# Altium schematic sheet zdoks.SchDoc: ZDOK Interfaces
size A3; Date: DO NOT USE, RATHER USE PROJ OPTIONS; DrawnBy: DO NOT USE, RATHER USE PROJ OPTIONS; Engineer: DO NOT USE, RATHER USE PROJ OPTIONS; Organization: DO NOT USE, RATHER USE PROJ OPTIONS; DocumentNumber: DO NOT USE, RATHER USE PROJ OPTIONS; Revision: DO NOT USE, RATHER USE PROJ OPTIONS; SheetNumber: 22; SheetTotal: 27; SCH_Sheet_Filename: zdoks.SchDoc; CurrentTime: DO NOT USE, RATHER USE PROJ OPTIONS; Time: DO NOT USE, RATHER USE PROJ OPTIONS; DocumentFullPathAndName: DO NOT USE, RATHER USE PROJ OPTIONS; DocumentName: DO NOT USE, RATHER USE PROJ OPTIONS; ModifiedDate: DO NOT USE, RATHER USE PROJ OPTIONS; ImagePath: DO NOT USE, RATHER USE PROJ OPTIONS
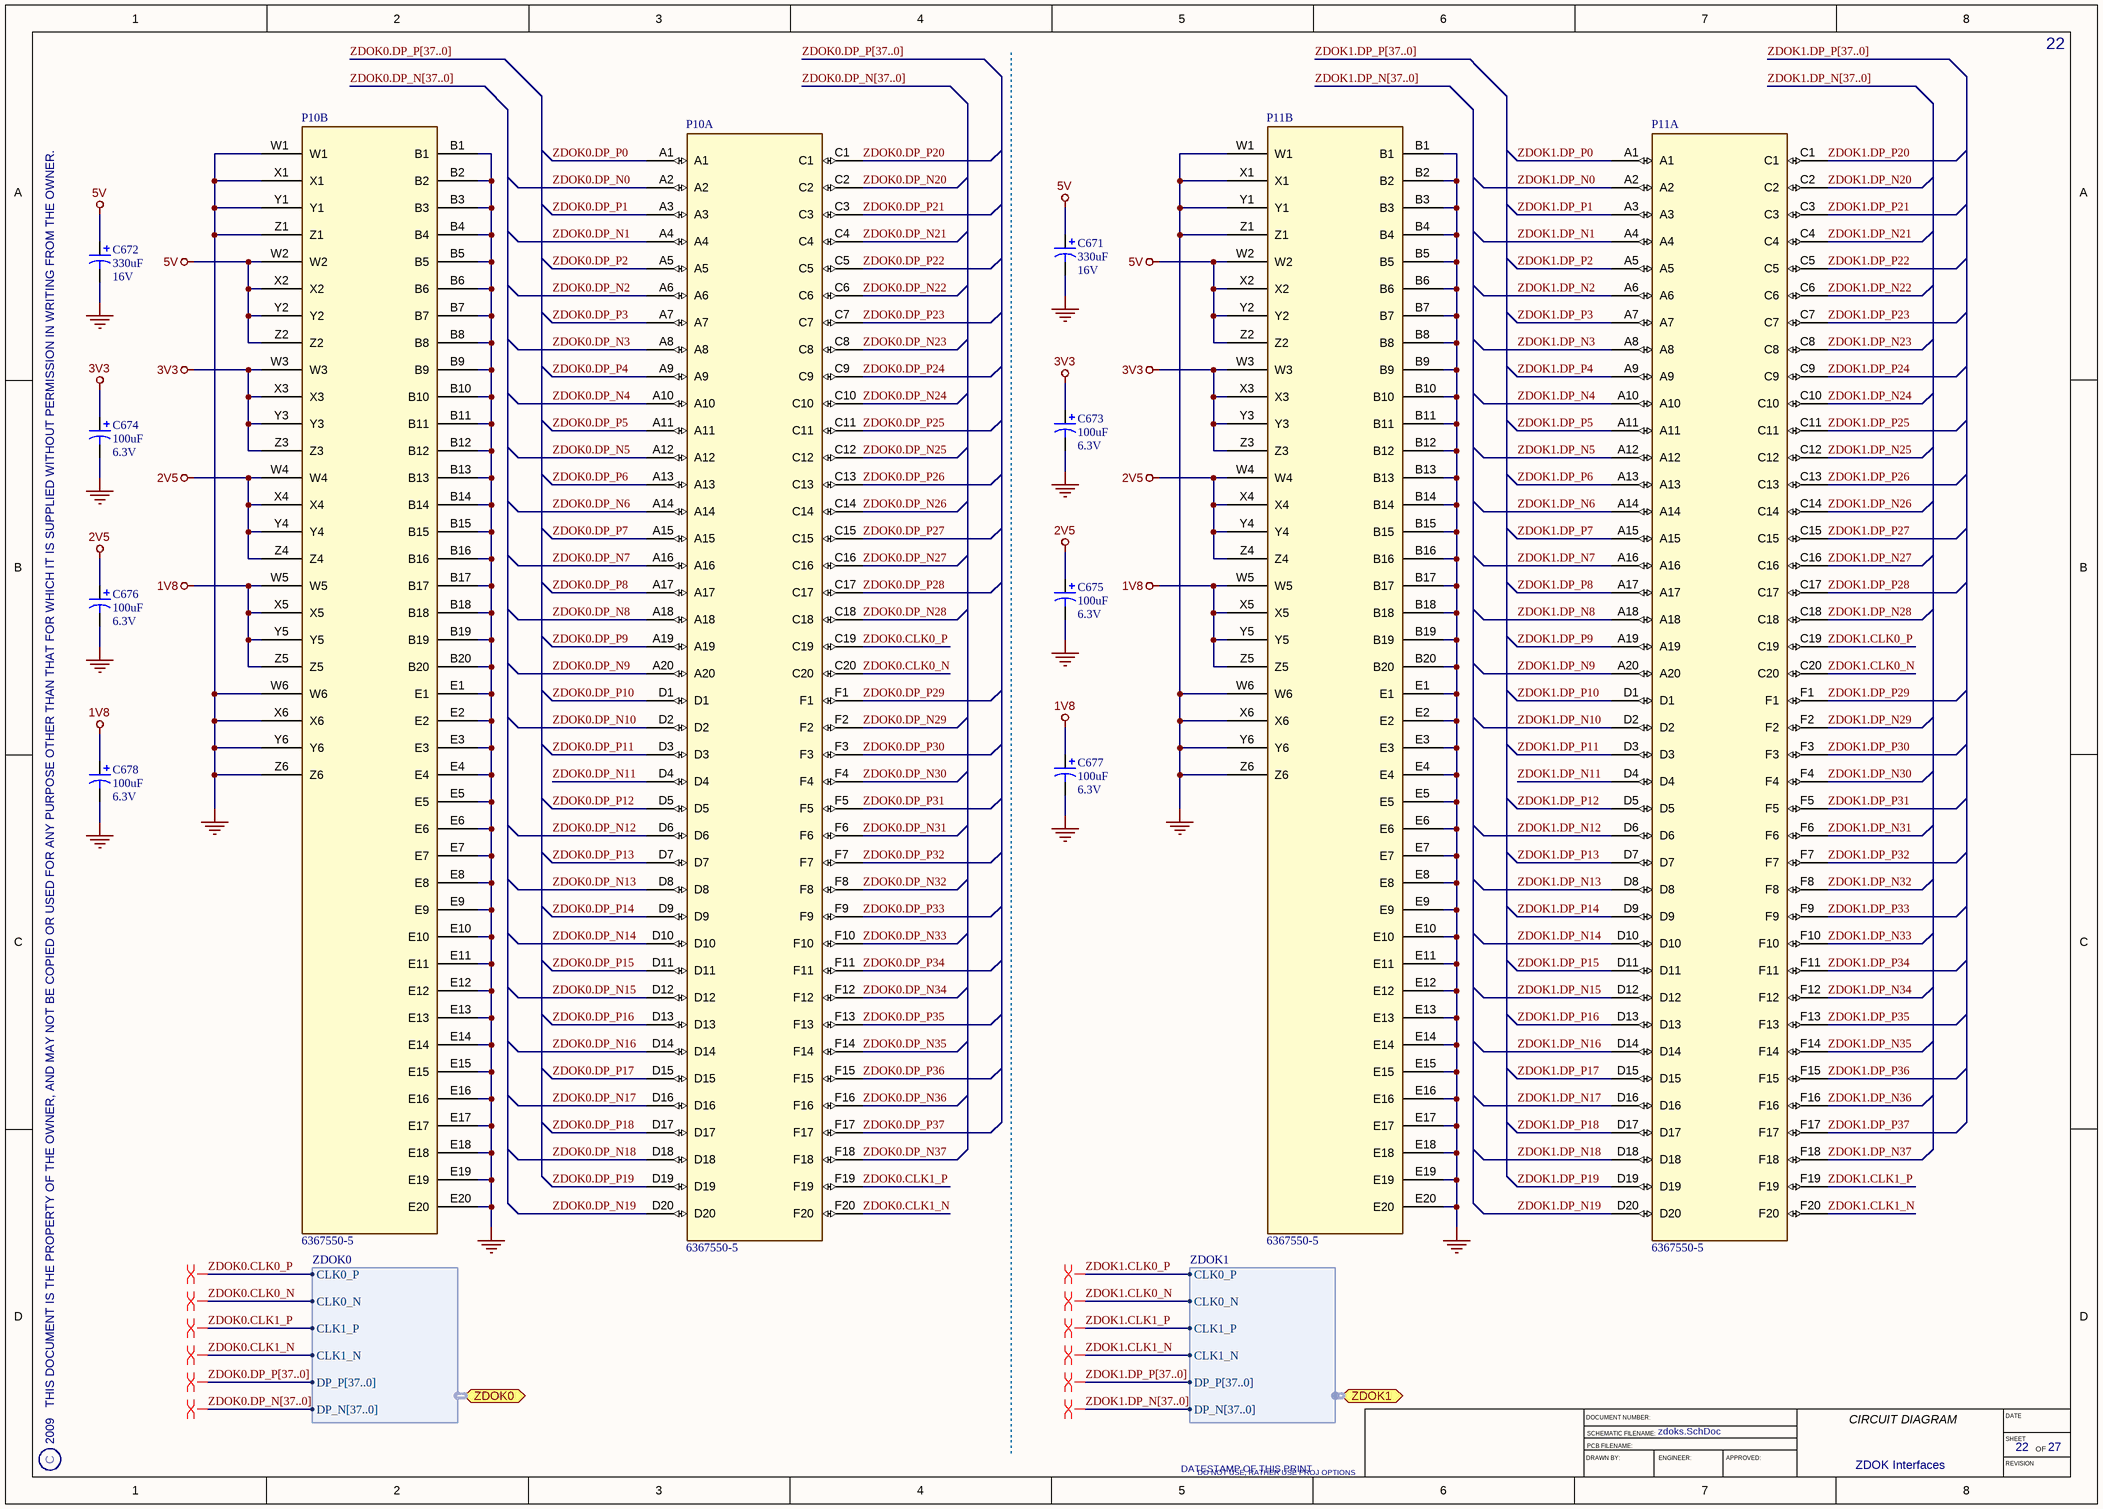
[diagram p0: zdoks.SchDoc]

## Parts
C671  Rating: 16V  [CAPMP7263X380L]  (hidden comment: 330uF)
C672  Rating: 16V  [CAPMP7263X380L]  (hidden comment: 330uF)
C673  Rating: 6.3V  [CAPMP3528X210L]  (hidden comment: 100uF)
C674  Rating: 6.3V  [CAPMP3528X210L]  (hidden comment: 100uF)
C675  Rating: 6.3V  [CAPMP3528X210L]  (hidden comment: 100uF)
C676  Rating: 6.3V  [CAPMP3528X210L]  (hidden comment: 100uF)
C677  Rating: 6.3V  [CAPMP3528X210L]  (hidden comment: 100uF)
C678  Rating: 6.3V  [CAPMP3528X210L]  (hidden comment: 100uF)
P10  6367550-5  [TYCO_6367550-5]  (parts A,B of 2)
P11  6367550-5  [TYCO_6367550-5]  (parts A,B of 2)

## Ports
ZDOK0 (harness ZDOK0), ZDOK1 (harness ZDOK1)

## Harnesses
ZDOK0: CLK0_P, CLK0_N, CLK1_P, CLK1_N, DP_P[37..0], DP_N[37..0]
ZDOK1: CLK0_P, CLK0_N, CLK1_P, CLK1_N, DP_P[37..0], DP_N[37..0]

## Nets
1V8: C677.1 C678.1 P10.W5 P10.X5 P10.Y5 P10.Z5 P11.W5 P11.X5 P11.Y5 P11.Z5
2V5: C675.1 C676.1 P10.W4 P10.X4 P10.Y4 P10.Z4 P11.W4 P11.X4 P11.Y4 P11.Z4
3V3: C673.1 C674.1 P10.W3 P10.X3 P10.Y3 P10.Z3 P11.W3 P11.X3 P11.Y3 P11.Z3
5V: C671.1 C672.1 P10.W2 P10.X2 P10.Y2 P10.Z2 P11.W2 P11.X2 P11.Y2 P11.Z2
GND: C671.2 C672.2 C673.2 C674.2 C675.2 C676.2 C677.2 C678.2 P10.B1 P10.B2 P10.B3 P10.B4 P10.B5 P10.B6 P10.B7 P10.B8 P10.B9 P10.B10 P10.B11 P10.B12 P10.B13 P10.B14 P10.B15 P10.B16 P10.B17 P10.B18 P10.B19 P10.B20 P10.E1 P10.E2 P10.E3 P10.E4 P10.E5 P10.E6 P10.E7 P10.E8 P10.E9 P10.E10 P10.E11 P10.E12 P10.E13 P10.E14 P10.E15 P10.E16 P10.E17 P10.E18 P10.E19 P10.E20 P10.W1 P10.W6 P10.X1 P10.X6 P10.Y1 P10.Y6 P10.Z1 P10.Z6 P11.B1 P11.B2 P11.B3 P11.B4 P11.B5 P11.B6 P11.B7 P11.B8 P11.B9 P11.B10 P11.B11 P11.B12 P11.B13 P11.B14 P11.B15 P11.B16 P11.B17 P11.B18 P11.B19 P11.B20 P11.E1 P11.E2 P11.E3 P11.E4 P11.E5 P11.E6 P11.E7 P11.E8 P11.E9 P11.E10 P11.E11 P11.E12 P11.E13 P11.E14 P11.E15 P11.E16 P11.E17 P11.E18 P11.E19 P11.E20 P11.W1 P11.W6 P11.X1 P11.X6 P11.Y1 P11.Y6 P11.Z1 P11.Z6
ZDOK0.CLK0_N: P10.C20 ; port ZDOK0.CLK0_N
ZDOK0.CLK0_P: P10.C19 ; port ZDOK0.CLK0_P
ZDOK0.CLK1_N: P10.F20 ; port ZDOK0.CLK1_N
ZDOK0.CLK1_P: P10.F19 ; port ZDOK0.CLK1_P
ZDOK0.DP_N0: P10.A2
ZDOK0.DP_N1: P10.A4
ZDOK0.DP_N2: P10.A6
ZDOK0.DP_N3: P10.A8
ZDOK0.DP_N4: P10.A10
ZDOK0.DP_N5: P10.A12
ZDOK0.DP_N6: P10.A14
ZDOK0.DP_N7: P10.A16
ZDOK0.DP_N8: P10.A18
ZDOK0.DP_N9: P10.A20
ZDOK0.DP_N10: P10.D2
ZDOK0.DP_N11: P10.D4
ZDOK0.DP_N12: P10.D6
ZDOK0.DP_N13: P10.D8
ZDOK0.DP_N14: P10.D10
ZDOK0.DP_N15: P10.D12
ZDOK0.DP_N16: P10.D14
ZDOK0.DP_N17: P10.D16
ZDOK0.DP_N18: P10.D18
ZDOK0.DP_N19: P10.D20
ZDOK0.DP_N20: P10.C2
ZDOK0.DP_N21: P10.C4
ZDOK0.DP_N22: P10.C6
ZDOK0.DP_N23: P10.C8
ZDOK0.DP_N24: P10.C10
ZDOK0.DP_N25: P10.C12
ZDOK0.DP_N26: P10.C14
ZDOK0.DP_N27: P10.C16
ZDOK0.DP_N28: P10.C18
ZDOK0.DP_N29: P10.F2
ZDOK0.DP_N30: P10.F4
ZDOK0.DP_N31: P10.F6
ZDOK0.DP_N32: P10.F8
ZDOK0.DP_N33: P10.F10
ZDOK0.DP_N34: P10.F12
ZDOK0.DP_N35: P10.F14
ZDOK0.DP_N36: P10.F16
ZDOK0.DP_N37: P10.F18
ZDOK0.DP_P0: P10.A1
ZDOK0.DP_P1: P10.A3
ZDOK0.DP_P2: P10.A5
ZDOK0.DP_P3: P10.A7
ZDOK0.DP_P4: P10.A9
ZDOK0.DP_P5: P10.A11
ZDOK0.DP_P6: P10.A13
ZDOK0.DP_P7: P10.A15
ZDOK0.DP_P8: P10.A17
ZDOK0.DP_P9: P10.A19
ZDOK0.DP_P10: P10.D1
ZDOK0.DP_P11: P10.D3
ZDOK0.DP_P12: P10.D5
ZDOK0.DP_P13: P10.D7
ZDOK0.DP_P14: P10.D9
ZDOK0.DP_P15: P10.D11
ZDOK0.DP_P16: P10.D13
ZDOK0.DP_P17: P10.D15
ZDOK0.DP_P18: P10.D17
ZDOK0.DP_P19: P10.D19
ZDOK0.DP_P20: P10.C1
ZDOK0.DP_P21: P10.C3
ZDOK0.DP_P22: P10.C5
ZDOK0.DP_P23: P10.C7
ZDOK0.DP_P24: P10.C9
ZDOK0.DP_P25: P10.C11
ZDOK0.DP_P26: P10.C13
ZDOK0.DP_P27: P10.C15
ZDOK0.DP_P28: P10.C17
ZDOK0.DP_P29: P10.F1
ZDOK0.DP_P30: P10.F3
ZDOK0.DP_P31: P10.F5
ZDOK0.DP_P32: P10.F7
ZDOK0.DP_P33: P10.F9
ZDOK0.DP_P34: P10.F11
ZDOK0.DP_P35: P10.F13
ZDOK0.DP_P36: P10.F15
ZDOK0.DP_P37: P10.F17
ZDOK1.CLK0_N: P11.C20 ; port ZDOK1.CLK0_N
ZDOK1.CLK0_P: P11.C19 ; port ZDOK1.CLK0_P
ZDOK1.CLK1_N: P11.F20 ; port ZDOK1.CLK1_N
ZDOK1.CLK1_P: P11.F19 ; port ZDOK1.CLK1_P
ZDOK1.DP_N0: P11.A2
ZDOK1.DP_N1: P11.A4
ZDOK1.DP_N2: P11.A6
ZDOK1.DP_N3: P11.A8
ZDOK1.DP_N4: P11.A10
ZDOK1.DP_N5: P11.A12
ZDOK1.DP_N6: P11.A14
ZDOK1.DP_N7: P11.A16
ZDOK1.DP_N8: P11.A18
ZDOK1.DP_N9: P11.A20
ZDOK1.DP_N10: P11.D2
ZDOK1.DP_N11: P11.D4
ZDOK1.DP_N12: P11.D6
ZDOK1.DP_N13: P11.D8
ZDOK1.DP_N14: P11.D10
ZDOK1.DP_N15: P11.D12
ZDOK1.DP_N16: P11.D14
ZDOK1.DP_N17: P11.D16
ZDOK1.DP_N18: P11.D18
ZDOK1.DP_N19: P11.D20
ZDOK1.DP_N20: P11.C2
ZDOK1.DP_N21: P11.C4
ZDOK1.DP_N22: P11.C6
ZDOK1.DP_N23: P11.C8
ZDOK1.DP_N24: P11.C10
ZDOK1.DP_N25: P11.C12
ZDOK1.DP_N26: P11.C14
ZDOK1.DP_N27: P11.C16
ZDOK1.DP_N28: P11.C18
ZDOK1.DP_N29: P11.F2
ZDOK1.DP_N30: P11.F4
ZDOK1.DP_N31: P11.F6
ZDOK1.DP_N32: P11.F8
ZDOK1.DP_N33: P11.F10
ZDOK1.DP_N34: P11.F12
ZDOK1.DP_N35: P11.F14
ZDOK1.DP_N36: P11.F16
ZDOK1.DP_N37: P11.F18
ZDOK1.DP_P0: P11.A1
ZDOK1.DP_P1: P11.A3
ZDOK1.DP_P2: P11.A5
ZDOK1.DP_P3: P11.A7
ZDOK1.DP_P4: P11.A9
ZDOK1.DP_P5: P11.A11
ZDOK1.DP_P6: P11.A13
ZDOK1.DP_P7: P11.A15
ZDOK1.DP_P8: P11.A17
ZDOK1.DP_P9: P11.A19
ZDOK1.DP_P10: P11.D1
ZDOK1.DP_P11: P11.D3
ZDOK1.DP_P12: P11.D5
ZDOK1.DP_P13: P11.D7
ZDOK1.DP_P14: P11.D9
ZDOK1.DP_P15: P11.D11
ZDOK1.DP_P16: P11.D13
ZDOK1.DP_P17: P11.D15
ZDOK1.DP_P18: P11.D17
ZDOK1.DP_P19: P11.D19
ZDOK1.DP_P20: P11.C1
ZDOK1.DP_P21: P11.C3
ZDOK1.DP_P22: P11.C5
ZDOK1.DP_P23: P11.C7
ZDOK1.DP_P24: P11.C9
ZDOK1.DP_P25: P11.C11
ZDOK1.DP_P26: P11.C13
ZDOK1.DP_P27: P11.C15
ZDOK1.DP_P28: P11.C17
ZDOK1.DP_P29: P11.F1
ZDOK1.DP_P30: P11.F3
ZDOK1.DP_P31: P11.F5
ZDOK1.DP_P32: P11.F7
ZDOK1.DP_P33: P11.F9
ZDOK1.DP_P34: P11.F11
ZDOK1.DP_P35: P11.F13
ZDOK1.DP_P36: P11.F15
ZDOK1.DP_P37: P11.F17

## Buses and harness runs
bus ZDOK0.DP_N[37..0]
bus ZDOK0.DP_P[37..0]
bus ZDOK1.DP_N[37..0]
bus ZDOK1.DP_P[37..0]

## Layout directives
differential pair: (no net found under the mark), ZDOK0.CLK0_N, ZDOK0.CLK0_P, ZDOK0.CLK1_N, ZDOK0.CLK1_P, ZDOK1.CLK0_N, ZDOK1.CLK0_P, ZDOK1.CLK1_N, ZDOK1.CLK1_P

## Notes on the sheet
- 2009   THIS DOCUMENT IS THE PROPERTY OF THE OWNER, AND MAY NOT BE COPIED OR USED FOR ANY PURPOSE OTHER THAN THAT FOR WHICH IT IS SUPPLIED WITHOUT PERMISSION IN WRITING FROM THE OWNER.
- C
- DATESTAMP OF THIS PRINT
- DRAWN BY:
- DOCUMENT NUMBER:
- SCHEMATIC FILENAME:
- PCB FILENAME:
- ENGINEER:
- APPROVED:
- CIRCUIT DIAGRAM
- DATE
- SHEET
- REVISION
- OF

## Library data of the parts
C671 C672 = CAP-TAN-3: 330uF, Solid Tantalum Chip Capacitor; Manufacturer: VISHAY; PartNum: 594D337X0016R2T; Tolerance: 20%; ESR: 0.055; POD number: CAP-TAN-3; Value: 330uF; RoHS: Y; Sort Value: 330; Category: Capacitors; Subcategory: Tantalum
C673-C678 = CAP-TAN-6: 100uF, Low ESR, Tantalum Capacitor; Manufacturer: AVX; PartNum: TPSB107M006R0200; Tolerance: 20%; ESR: 0.2; POD number: CAP-TAN-6; Value: 100uF; RoHS: Y; Sort Value: 100; Category: Capacitors; Subcategory: Tantalum
P10 P11 = CONN-PCB-8: ZDOK+ Host Board Connector; Manufacturer: TYCO; POD number: CONN-PCB-8; PartNum: 6367550-5; RoHS: Y; Category: CONN; Subcategory: PCB